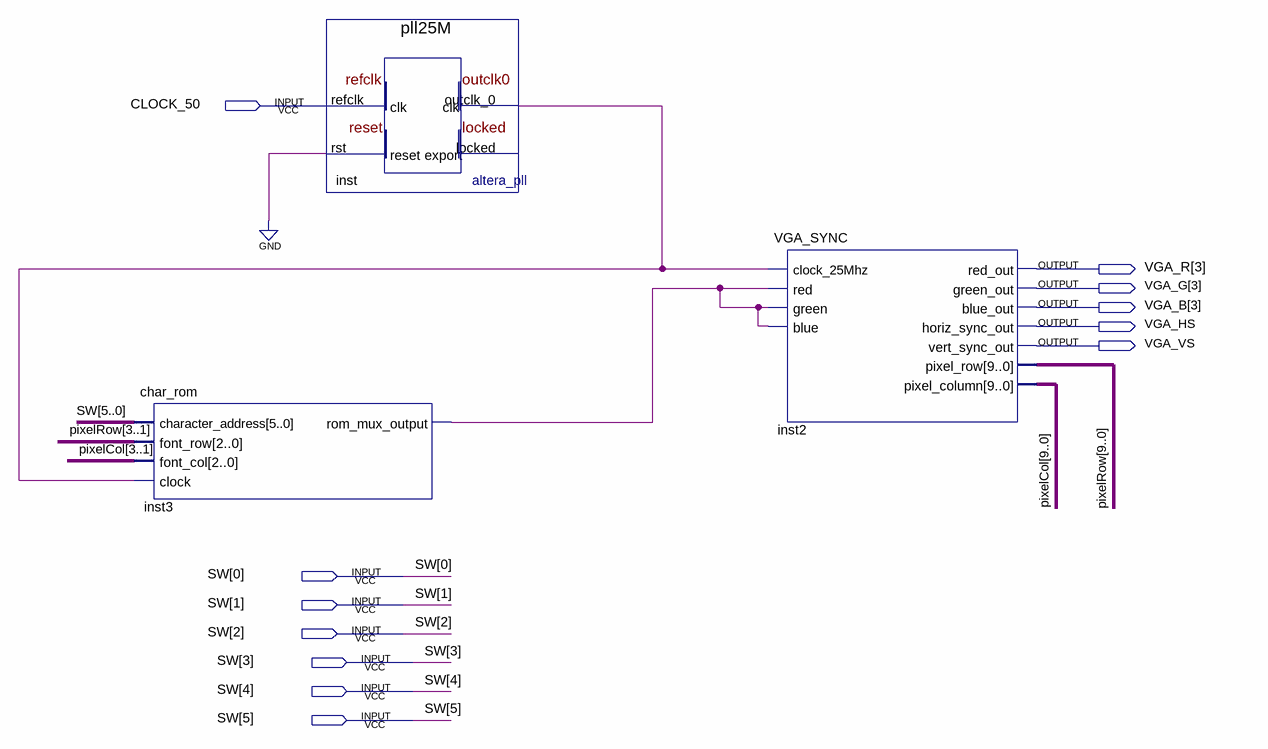
[diagram p0: schematic sheet]
// Quartus schematic text_testing.bdf as structural Verilog: 3 symbols, 12 pins
module text_testing (
  input  CLOCK_50,
  input  [5:0] SW,
  output [3:3] VGA_R,
  output [3:3] VGA_G,
  output [3:3] VGA_B,
  output VGA_HS,
  output VGA_VS
);

  wire inst3_rom_mux_output, inst_outclk_0;
  wire [9:0] pixelCol, pixelRow;

  char_rom inst3 (
    .character_address(SW), .font_row(pixelRow[3:1]), .font_col(pixelCol[3:1]), .clock(inst_outclk_0),
    .rom_mux_output(inst3_rom_mux_output));
  pll25M inst (.refclk(CLOCK_50), .rst(1'b0), .outclk_0(inst_outclk_0));  // open: locked
  VGA_SYNC inst2 (
    .clock_25Mhz(inst_outclk_0), .red(inst3_rom_mux_output), .green(inst3_rom_mux_output),
    .blue(inst3_rom_mux_output), .red_out(VGA_R[3]), .green_out(VGA_G[3]), .blue_out(VGA_B[3]),
    .horiz_sync_out(VGA_HS), .vert_sync_out(VGA_VS), .pixel_row(pixelRow), .pixel_column(pixelCol));
endmodule
